# EAGLE schematic untitled (EAGLE 6.1)
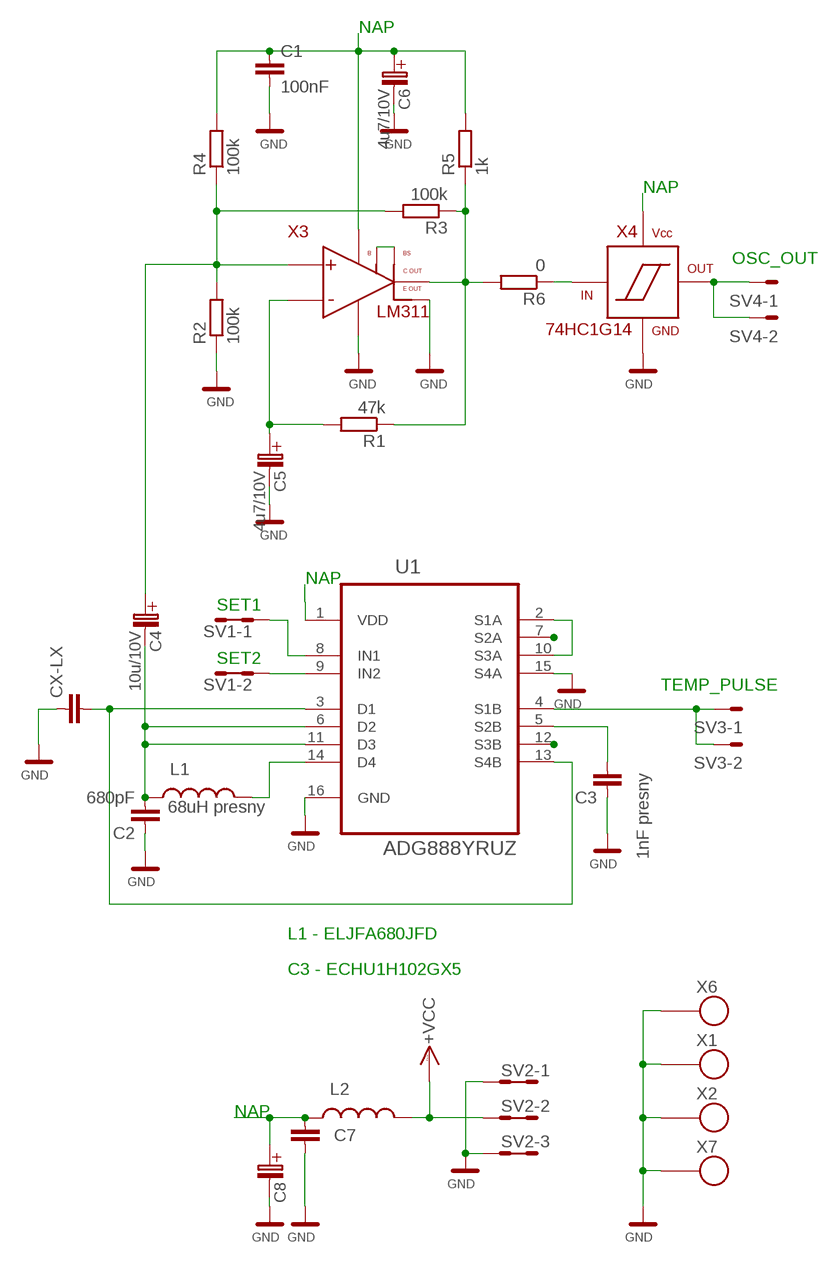
[diagram p0: schematic, sheet 1]

## Parts
C1  100nF  C0805  [C0805]
C2  680pF  C0805  [C0805]
C3  1nF presny  C0805  [C0805]
C4  10u/10V  B  [B]
C5  4u7/10V  B  [B]
C6  4u7/10V  B  [B]
C7  C0805  [C0805]
C8  B  [B]
CX-LX  SPEC_805  [SPEC_805]
L1  68uH presny  L1210  [1210]
L2  L1210  [1210]
R1  47k  R0805  [0805]
R2  100k  R0805  [0805]
R3  100k  R0805  [0805]
R4  100k  R0805  [0805]
R5  1k  R0805  [0805]
R6  0  R0805  [0805]
SV1  MA02-2  [MA02-2]
SV2  MA03-2  [MA03-2]
SV3  MA02-1  [MA02-1]
SV4  MA02-1  [MA02-1]
U1  ADG888YRUZ  [SOP65P640X120-16N]
X1  SROUB3M  [SROUB3M]
X2  SROUB3M  [SROUB3M]
X3  LM311  [SO8]
X4  74HC1G14  [SOT353]
X6  SROUB3M  [SROUB3M]
X7  SROUB3M  [SROUB3M]

## Nets
C+: CX-LX.2 U1.3(D1) U1.13(S4B)
GND: C1.2 C2.1 C3.1 C5.-(C_EL-) C6.-(C_EL-) C7.2 C8.-(C_EL-) CX-LX.1 R2.1 SV2.1 SV2.2 SV2.5 SV2.6 U1.15(S4A) U1.16(GND) X1.P$1 X2.P$1 X3.1(E_OUT) X3.4(GND) X4.3(GND) X6.P$1 X7.P$1
N$3: C2.2 C4.-(C_EL-) L1.P$1 U1.6(D2) U1.11(D3)
N$4: X3.5(B) X3.6(BS)
N$5: U1.7(S2A)
N$6: C3.2 U1.5(S2B)
N$7: U1.2(S1A) U1.10(S3A)
N$8: SV1.1 SV1.2 U1.8(IN1)
N$9: SV3.1 SV3.2 U1.4(S1B)
N$10: L1.P$2 U1.14(D4)
N$11: U1.12(S3B)
N$12: C5.+(C_EL+) R1.2 X3.3(-)
N$13: R1.1 R3.1 R5.1 R6.2 X3.7(VOUT)
N$14: SV1.3 SV1.4 U1.9(IN2)
N$15: R6.1 X4.2(IN)
N$16: C4.+(C_EL+) R2.2 R3.2 R4.1 X3.2(+)
N$17: SV4.1 SV4.2 X4.4(OUT)
NAP: C1.1 C6.+(C_EL+) C7.1 C8.+(C_EL+) L2.P$1 R4.2 R5.2 U1.1(VDD) X3.8(VDD) X4.5(VCC)
VCC: L2.P$2 SV2.3 SV2.4 ; supply symbol labelled +VCC

## Notes on the sheet
- NAP
- NAP
- OSC_OUT
- NAP
- SET1
- SET2
- TEMP_PULSE
- L1 - ELJFA680JFD
- C3 - ECHU1H102GX5
- NAP

## Library data of the parts
C1-C3 C7 = moje_C:C0805
C4-C6 C8 = moje_C:B
CX-LX = moje_C:SPEC_805
L1 L2 = moje_L:L1210
R1-R6 = moje_R:R0805
SV1 = moje_hrebinky:MA02-2
SV2 = moje_hrebinky:MA03-2: PIN HEADER; OC_FARNELL: unknown; OC_NEWARK: unknown
SV3 SV4 = moje_hrebinky:MA02-1
U1 = moje_tlacitka:ADG888YRUZ: 0.4 Ù CMOS, Dual DPDT Switch; MPN: ADG888YRUZ; OC_FARNELL: 1117866; OC_NEWARK: 19M0698; PACKAGE: TSSOP-16; SUPPLIER: Analog Devices
X1 X2 X6 X7 = moje:SROUB3M
X3 = moje_komp:LM311
X4 = moje_komp:74HC1G14: Schmitt, Trigger